# Altium schematic sheet Motor Driver.SchDoc
size A; SheetNumber: 3; SheetTotal: 4
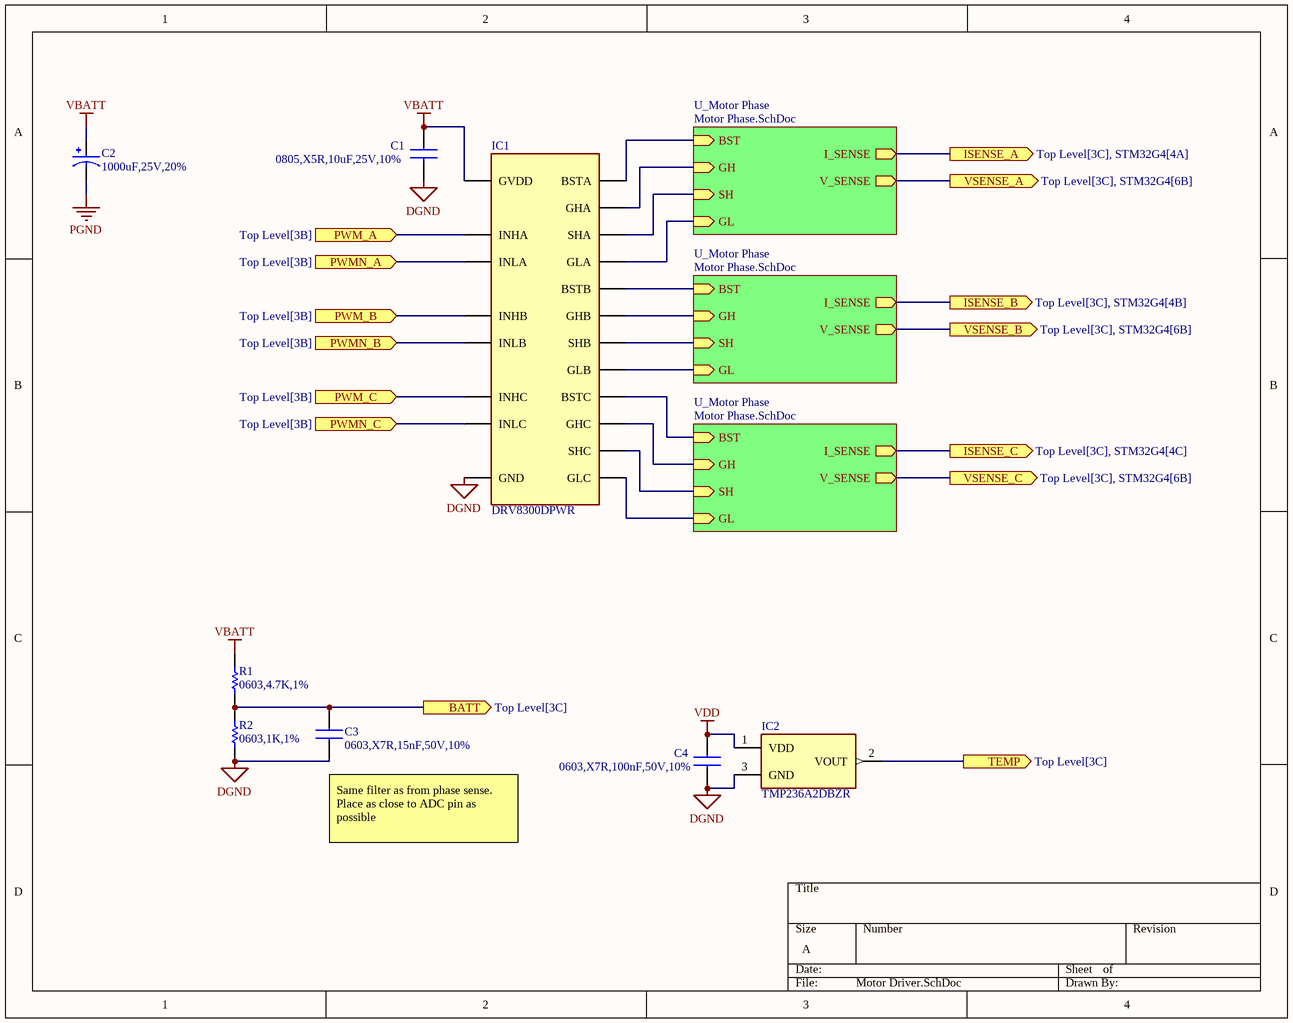
[diagram p0: Motor Driver.SchDoc]

## Parts
C1  0805,X5R,10uF,25V,10%  [CAPC2012X145N]
C2  1000uF,25V,20%  [CAP-TH_BD10.0-P5.00-D1.0-FD]
C3  0603,X7R,15nF,50V,10%  [CAPC1608X90N]
C4  0603,X7R,100nF,50V,10%  [CAPC1608X90N]
IC1  DRV8300DPWR  [SOP65P640X120-20N]
IC2  TMP236A2DBZR  [SOT95P237X112-3N]
R1  0603,4.7K,1%  [RESC1608X55N]
R2  0603,1K,1%  [RESC1608X55N]

## Sub-sheets
U_Motor Phase = Motor Phase.SchDoc: I_SENSE (out), V_SENSE (out), GH (in), BST (in), SH (in), GL (in)
U_Motor Phase = Motor Phase.SchDoc: I_SENSE (out), V_SENSE (out), GH (in), BST (in), SH (in), GL (in)
U_Motor Phase = Motor Phase.SchDoc: I_SENSE (out), V_SENSE (out), GH (in), BST (in), SH (in), GL (in)

## Ports
BATT (out, see Top Level[3C]), ISENSE_A (out, see Top Level[3C], STM32G4[4A]), ISENSE_B (out, see Top Level[3C], STM32G4[4B]), ISENSE_C (out, see Top Level[3C], STM32G4[4C]), PWM_A (in, see Top Level[3B]), PWM_B (in, see Top Level[3B]), PWM_C (in, see Top Level[3B]), PWMN_A (in, see Top Level[3B]), PWMN_B (in, see Top Level[3B]), PWMN_C (in, see Top Level[3B]), TEMP (out, see Top Level[3C]), VSENSE_A (out, see Top Level[3C], STM32G4[6B]), VSENSE_B (out, see Top Level[3C], STM32G4[6B]), VSENSE_C (out, see Top Level[3C], STM32G4[6B])

## Nets
DGND: C1.1 C3.1 C4.1 IC1.8(GND) IC2.3(GND) R2.1
PGND: C2.2
VBATT: C1.2 C2.1 IC1.7(GVDD) R1.2
VDD: C4.2 IC2.1(VDD)
BATT: C3.2 R1.1 R2.2 ; port BATT
ISENSE_A: port ISENSE_A, sheet U_Motor Phase/I_SENSE
ISENSE_B: port ISENSE_B, sheet U_Motor Phase/I_SENSE
ISENSE_C: port ISENSE_C, sheet U_Motor Phase/I_SENSE
PWM_A: IC1.1(INHA) ; port PWM_A
PWM_B: IC1.2(INHB) ; port PWM_B
PWM_C: IC1.3(INHC) ; port PWM_C
PWMN_A: IC1.4(INLA) ; port PWMN_A
PWMN_B: IC1.5(INLB) ; port PWMN_B
PWMN_C: IC1.6(INLC) ; port PWMN_C
TEMP: IC2.2(VOUT) ; port TEMP
VSENSE_A: port VSENSE_A, sheet U_Motor Phase/V_SENSE
VSENSE_B: port VSENSE_B, sheet U_Motor Phase/V_SENSE
VSENSE_C: port VSENSE_C, sheet U_Motor Phase/V_SENSE
NetIC1_9: IC1.9(GLC) ; sheet U_Motor Phase/GL
NetIC1_10: IC1.10(GLB) ; sheet U_Motor Phase/GL
NetIC1_11: IC1.11(GLA) ; sheet U_Motor Phase/GL
NetIC1_12: IC1.12(SHC) ; sheet U_Motor Phase/SH
NetIC1_13: IC1.13(GHC) ; sheet U_Motor Phase/GH
NetIC1_14: IC1.14(BSTC) ; sheet U_Motor Phase/BST
NetIC1_15: IC1.15(SHB) ; sheet U_Motor Phase/SH
NetIC1_16: IC1.16(GHB) ; sheet U_Motor Phase/GH
NetIC1_17: IC1.17(BSTB) ; sheet U_Motor Phase/BST
NetIC1_18: IC1.18(SHA) ; sheet U_Motor Phase/SH
NetIC1_19: IC1.19(GHA) ; sheet U_Motor Phase/GH
NetIC1_20: IC1.20(BSTA) ; sheet U_Motor Phase/BST

## Notes on the sheet
- (near C3) Same filter as from phase sense.
  Place as close to ADC pin as possible

## Library data of the parts
C1 = CC0805KKX5R8BB106: 10 µF ±10% 25V Ceramic Capacitor X5R 0805 (2012 Metric); Manufacturer_Name: YAGEO; Datasheet Link: https://www.yageo.com/upload/media/product/productsearch/datasheet/mlcc/UPY-GPHC_X5R_4V-to-50V_27.pdf; Height: 1.45mm; Manufacturer_Part_Number: CC0805KKX5R8BB106; Mouser Part Number: 603-CC805KKX5R8BB106; Mouser Price/Stock: https://www.mouser.co.uk/ProductDetail/YAGEO/CC0805KKX5R8BB106?qs=57cj7OiSijm89pM64t1AGQ%3D%3D; Arrow Part Number: CC0805KKX5R8BB106; Arrow Price/Stock: https://www.arrow.com/en/products/cc0805kkx5r8bb106/yageo?utm_currency=USD&region=nac; LCSC Part #: C89831
C2 = 25PK1000MEFC10*16: 1000uF 25V ±20% 870mA@120Hz Through Hole,D10xL16mm Aluminum Electrolytic Capacitors - Leaded ROHS; LCSC Part #: C109451
C3 = CC0603KRX7R9BB153: 50V 15nF X7R ±10% 0603 Multilayer Ceramic Capacitors MLCC - SMD/SMT ROHS; Manufacturer_Name: YAGEO; Datasheet Link: https://componentsearchengine.com/Datasheets/2/CC0603KRX7R9BB104.pdf; Height: 0.9mm; Manufacturer_Part_Number: CC0603KRX7R9BB153; Mouser Part Number: 603-CC603KRX7R9BB104; Mouser Price/Stock: https://www.mouser.co.uk/ProductDetail/YAGEO/CC0603KRX7R9BB104?qs=vTakOoo5QyLvVCYM2ge8LQ%3D%3D; Arrow Part Number: CC0603KRX7R9BB104; Arrow Price/Stock: https://www.arrow.com/en/products/cc0603krx7r9bb104/yageo?utm_currency=USD&region=europe; LCSC Part #: C107076
C4 = CC0603KRX7R9BB104: 50V 100nF X7R ±10% 0603 Multilayer Ceramic Capacitors MLCC - SMD/SMT ROHS; Manufacturer_Name: YAGEO; Datasheet Link: https://componentsearchengine.com/Datasheets/2/CC0603KRX7R9BB104.pdf; Height: 0.9mm; Manufacturer_Part_Number: CC0603KRX7R9BB104; Mouser Part Number: 603-CC603KRX7R9BB104; Mouser Price/Stock: https://www.mouser.co.uk/ProductDetail/YAGEO/CC0603KRX7R9BB104?qs=vTakOoo5QyLvVCYM2ge8LQ%3D%3D; Arrow Part Number: CC0603KRX7R9BB104; Arrow Price/Stock: https://www.arrow.com/en/products/cc0603krx7r9bb104/yageo?utm_currency=USD&region=europe; LCSC Part #: C14663
IC1 = DRV8300DPWR: TSSOP-20 Brushless DC (BLDC) Motor Driver ROHS; Manufacturer_Name: Texas Instruments; Height: 1.2mm; Manufacturer_Part_Number: DRV8300DPWR; Mouser Part Number: 595-DRV8300DPWR; Mouser Price/Stock: https://www.mouser.co.uk/ProductDetail/Texas-Instruments/DRV8300DPWR?qs=eP2BKZSCXI6qJbKdYnGwBg%3D%3D; Arrow Part Number: DRV8300DPWR; Arrow Price/Stock: https://www.arrow.com/en/products/drv8300dpwr/texas-instruments?utm_currency=USD&region=nac; LCSC Part #: C3036056
IC2 = TMP236A2DBZR: Low-power and high-precision analog output temperature sensor; Manufacturer_Name: Texas Instruments; Datasheet Link: http://www.ti.com/lit/gpn/tmp236; Height: 1.12mm; Manufacturer_Part_Number: TMP236A2DBZR; Mouser Part Number: 595-TMP236A2DBZR; Mouser Price/Stock: https://www.mouser.co.uk/ProductDetail/Texas-Instruments/TMP236A2DBZR?qs=lc2O%252BfHJPVanftlPgPUvow%3D%3D; Arrow Part Number: TMP236A2DBZR; Arrow Price/Stock: https://www.arrow.com/en/products/tmp236a2dbzr/texas-instruments?region=nac; LCSC Part #: C2859666
R1 = RC0603FR-074K7L: 100mW Thick Film Resistor 75V ±100ppm/℃ ±1% 4.7kΩ 0603 Chip Resistor - Surface Mount ROHS; Manufacturer_Name: YAGEO; Datasheet Link: https://www.mouser.com/catalog/specsheets/YAGEO_PYu_RC_Group_51_RoHS_L_12.pdf; Height: 0.55mm; Manufacturer_Part_Number: RC0603FR-074K7L; LCSC Part #: C99782
R2 = RC0603FR-071KL: 100mW Thick Film Resistor 75V ±100ppm/℃ ±1% 1kΩ 0603 Chip Resistor - Surface Mount ROHS; Manufacturer_Name: YAGEO; Datasheet Link: https://www.mouser.com/catalog/specsheets/YAGEO_PYu_RC_Group_51_RoHS_L_12.pdf; Height: 0.55mm; Manufacturer_Part_Number: RC0603FR-071KL; LCSC Part #: C22548